# Altium schematic sheet QSPI Flash_eMMC_uSD-Card.SchDoc
size A3; SheetNumber: 14; SheetTotal: 22
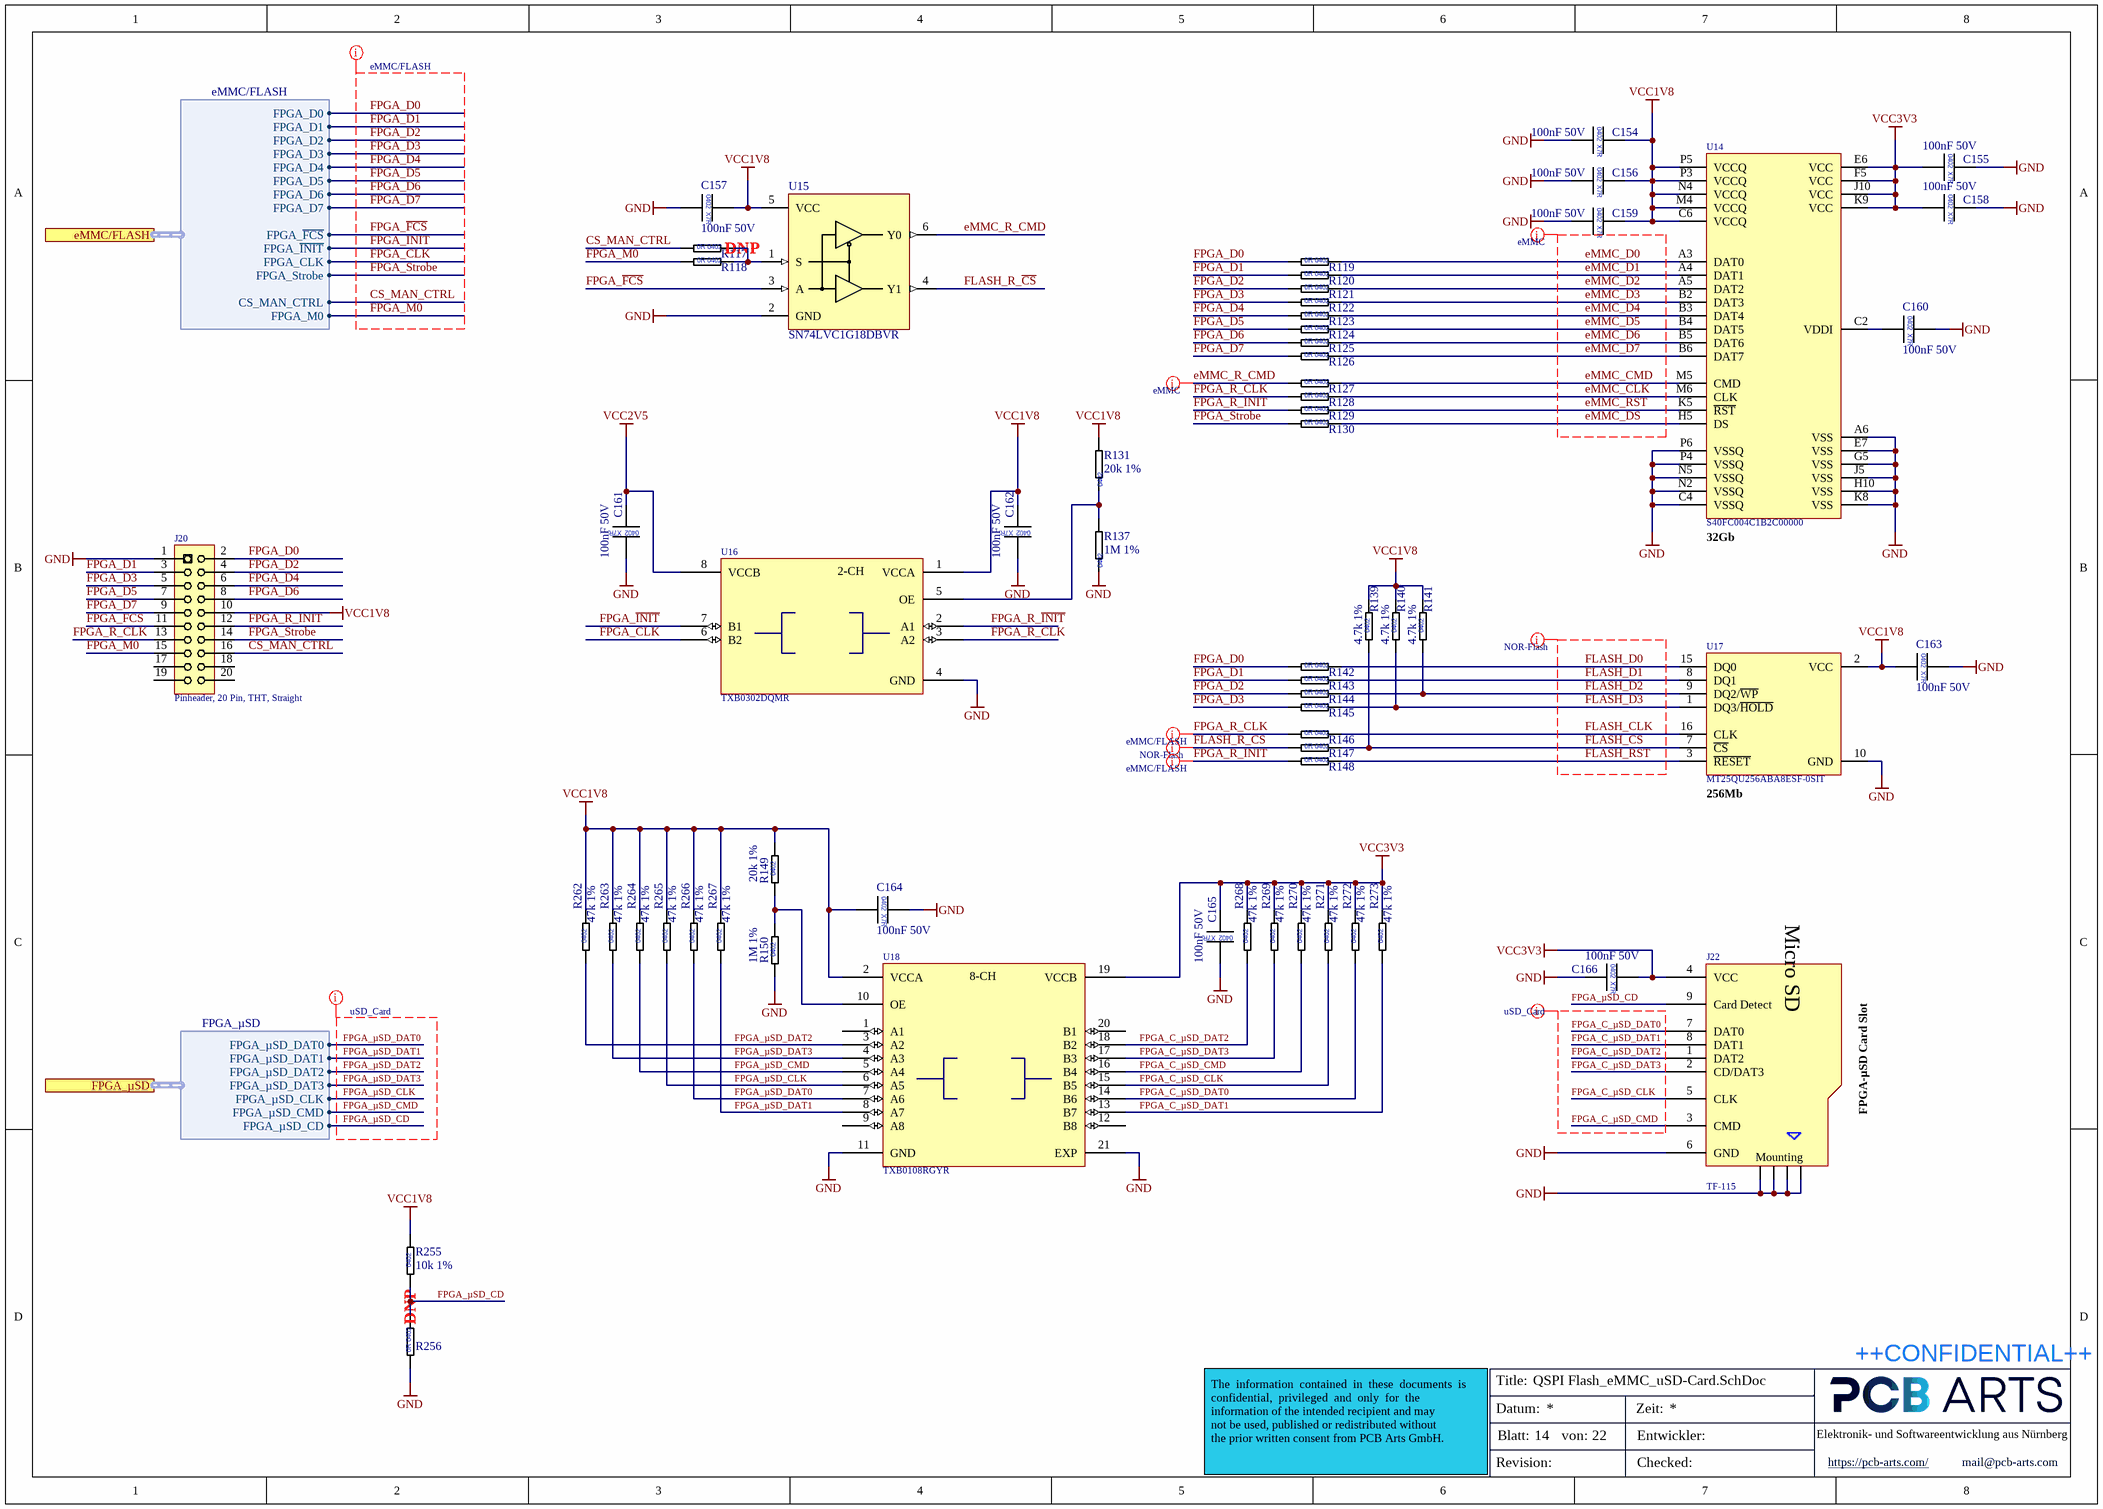
[diagram p0: QSPI Flash_eMMC_uSD-Card.SchDoc]

## Parts
C154  100nF 50V  [CAP_0402_L]
C155  100nF 50V  [CAP_0402_L]
C156  100nF 50V  [CAP_0402_L]
C157  100nF 50V  [CAP_0402_L]
C158  100nF 50V  [CAP_0402_L]
C159  100nF 50V  [CAP_0402_L]
C160  100nF 50V  [CAP_0402_L]
C161  100nF 50V  [CAP_0402_L]
C162  100nF 50V  [CAP_0402_L]
C163  100nF 50V  [CAP_0402_L]
C164  100nF 50V  [CAP_0402_L]
C165  100nF 50V  [CAP_0402_L]
C166  100nF 50V  [CAP_0402_L]
J20  Pinheader, 20 Pin, THT, Straight  [62702021621]
J22  TF-115  [TF-115]
R117  0R Jumper  [RES_0402_L]  (value not drawn)  (no BOM)
R118  0R Jumper  [RES_0402_L]  (value not drawn)
R119  0R Jumper  [RES_0402_L]  (value not drawn)
R120  0R Jumper  [RES_0402_L]  (value not drawn)
R121  0R Jumper  [RES_0402_L]  (value not drawn)
R122  0R Jumper  [RES_0402_L]  (value not drawn)
R123  0R Jumper  [RES_0402_L]  (value not drawn)
R124  0R Jumper  [RES_0402_L]  (value not drawn)
R125  0R Jumper  [RES_0402_L]  (value not drawn)
R126  0R Jumper  [RES_0402_L]  (value not drawn)
R127  0R Jumper  [RES_0402_L]  (value not drawn)
R128  0R Jumper  [RES_0402_L]  (value not drawn)
R129  0R Jumper  [RES_0402_L]  (value not drawn)
R130  0R Jumper  [RES_0402_L]  (value not drawn)
R131  20k 1%  [RES_0402_L]
R137  1M 1%  [RES_0402_L]
R139  4.7k 1%  [RES_0402_L]
R140  4.7k 1%  [RES_0402_L]
R141  4.7k 1%  [RES_0402_L]
R142  0R Jumper  [RES_0402_L]  (value not drawn)
R143  0R Jumper  [RES_0402_L]  (value not drawn)
R144  0R Jumper  [RES_0402_L]  (value not drawn)
R145  0R Jumper  [RES_0402_L]  (value not drawn)
R146  0R Jumper  [RES_0402_L]  (value not drawn)
R147  0R Jumper  [RES_0402_L]  (value not drawn)
R148  0R Jumper  [RES_0402_L]  (value not drawn)
R149  20k 1%  [RES_0402_L]
R150  1M 1%  [RES_0402_L]
R255  10k 1%  [RES_0402_L]
R256  0R Jumper  [RES_0402]  (value not drawn)  (no BOM)
R262  47k 1%  [RES_0402_L]
R263  47k 1%  [RES_0402_L]
R264  47k 1%  [RES_0402_L]
R265  47k 1%  [RES_0402_L]
R266  47k 1%  [RES_0402_L]
R267  47k 1%  [RES_0402_L]
R268  47k 1%  [RES_0402_L]
R269  47k 1%  [RES_0402_L]
R270  47k 1%  [RES_0402_L]
R271  47k 1%  [RES_0402_L]
R272  47k 1%  [RES_0402_L]
R273  47k 1%  [RES_0402_L]
U14  S40FC004C1B2C00000  [BGA50P900X750X080-153N]
U15  SN74LVC1G18DBVR  [SOT95P275X110-6N]
U16  TXB0302DQMR  [SON40P120X40-8N]
U17  MT25QU256ABA8ESF-0SIT  [SOIC16_Widebody]
U18  TXB0108RGYR  [QFN50P450X350X100-21N]

## Ports
eMMC/FLASH (harness eMMC/FLASH, see Top-Level-Sheet[3B], Bank 0_Bank 14[8A]), FPGA_µSD (harness FPGA_µSD, see Top-Level-Sheet[3B], SMI Bank 12[1B])

## Harnesses
FPGA_µSD: FPGA_µSD_DAT0, FPGA_µSD_DAT1, FPGA_µSD_DAT3, FPGA_µSD_CLK, FPGA_µSD_CMD, FPGA_µSD_DAT2, FPGA_µSD_CD
eMMC/FLASH: FPGA_D0, FPGA_D1, FPGA_D2, FPGA_D3, FPGA_D4, FPGA_D5, FPGA_D6, FPGA_D7, FPGA_~{FCS}, FPGA_~{INIT}, FPGA_CLK, FPGA_Strobe, FPGA_M0, CS_MAN_CTRL

## Nets
GND: C154.2 C155.1 C156.2 C157.2 C158.1 C159.2 C160.1 C161.1 C162.1 C163.1 C164.1 C165.1 C166.2 J20.1 J22.6(GND) J22.10 J22.11 J22.12 J22.13 R137.1 R150.1 R256.1 U14.A6(VSS) U14.C4(VSSQ) U14.E7(VSS) U14.G5(VSS) U14.H10(VSS) U14.J5(VSS) U14.K8(VSS) U14.N2(VSSQ) U14.N5(VSSQ) U14.P4(VSSQ) U14.P6(VSSQ) U15.2(GND) U16.4(GND) U17.10(GND) U18.11(GND) U18.21(EXP)
VCC1V8: C154.1 C156.1 C157.1 C159.1 C162.2 C163.2 C164.2 J20.10 R131.2 R139.2 R140.2 R141.2 R149.2 R255.2 R262.2 R263.2 R264.2 R265.2 R266.2 R267.2 U14.C6(VCCQ) U14.M4(VCCQ) U14.N4(VCCQ) U14.P3(VCCQ) U14.P5(VCCQ) U15.5(VCC) U16.1(VCCA) U17.2(VCC) U18.2(VCCA)
VCC2V5: C161.2 U16.8(VCCB)
VCC3V3: C155.2 C158.2 C165.2 C166.1 J22.4(VCC) R268.2 R269.2 R270.2 R271.2 R272.2 R273.2 U14.E6(VCC) U14.F5(VCC) U14.J10(VCC) U14.K9(VCC) U18.19(VCCB)
CS_MAN_CTRL: J20.16 R117.1 ; port eMMC/FLASH.CS_MAN_CTRL
eMMC_CLK: R128.2 U14.M6(CLK)
eMMC_CMD: R127.2 U14.M5(CMD)
eMMC_D0: R119.2 U14.A3(DAT0)
eMMC_D1: R120.2 U14.A4(DAT1)
eMMC_D2: R121.2 U14.A5(DAT2)
eMMC_D3: R122.2 U14.B2(DAT3)
eMMC_D4: R123.2 U14.B3(DAT4)
eMMC_D5: R124.2 U14.B4(DAT5)
eMMC_D6: R125.2 U14.B5(DAT6)
eMMC_D7: R126.2 U14.B6(DAT7)
eMMC_DS: R130.2 U14.H5(DS)
eMMC_~{RST}: R129.2 U14.K5(~{RST})
eMMC_R_CMD: R127.1 U15.6(Y0)
FLASH_~{CS}: R139.1 R147.2 U17.7(~{CS})
FLASH_CLK: R146.2 U17.16(CLK)
FLASH_D0: R142.2 U17.15(DQ0)
FLASH_D1: R143.2 U17.8(DQ1)
FLASH_D2: R141.1 R144.2 U17.9(DQ2/~{WP})
FLASH_D3: R140.1 R145.2 U17.1(DQ3/~{HOLD})
FLASH_~{RST}: R148.2 U17.3(~{RESET})
FLASH_R_~{CS}: R147.1 U15.4(Y1)
FPGA_C_µSD_CLK: J22.5(CLK) R271.1 U18.15(B5)
FPGA_C_µSD_CMD: J22.3(CMD) R270.1 U18.16(B4)
FPGA_C_µSD_DAT0: J22.7(DAT0) R272.1 U18.14(B6)
FPGA_C_µSD_DAT1: J22.8(DAT1) R273.1 U18.13(B7)
FPGA_C_µSD_DAT2: J22.1(DAT2) R268.1 U18.18(B2)
FPGA_C_µSD_DAT3: J22.2(CD/DAT3) R269.1 U18.17(B3)
FPGA_CLK: U16.6(B2) ; port eMMC/FLASH.FPGA_CLK
FPGA_D0: J20.2 R119.1 R142.1 ; port eMMC/FLASH.FPGA_D0
FPGA_D1: J20.3 R120.1 R143.1 ; port eMMC/FLASH.FPGA_D1
FPGA_D2: J20.4 R121.1 R144.1 ; port eMMC/FLASH.FPGA_D2
FPGA_D3: J20.5 R122.1 R145.1 ; port eMMC/FLASH.FPGA_D3
FPGA_D4: J20.6 R123.1 ; port eMMC/FLASH.FPGA_D4
FPGA_D5: J20.7 R124.1 ; port eMMC/FLASH.FPGA_D5
FPGA_D6: J20.8 R125.1 ; port eMMC/FLASH.FPGA_D6
FPGA_D7: J20.9 R126.1 ; port eMMC/FLASH.FPGA_D7
FPGA_~{FCS}: J20.11 U15.3(A) ; port eMMC/FLASH.FPGA_~{FCS}
FPGA_~{INIT}: U16.7(B1) ; port eMMC/FLASH.FPGA_~{INIT}
FPGA_M0: J20.15 R118.1 ; port eMMC/FLASH.FPGA_M0
FPGA_R_CLK: J20.13 R128.1 R146.1 U16.3(A2)
FPGA_R_~{INIT}: J20.12 R129.1 R148.1 U16.2(A1)
FPGA_Strobe: J20.14 R130.1 ; port eMMC/FLASH.FPGA_Strobe
FPGA_µSD_CD: J22.9(Card_Detect) R255.1 R256.2 ; port FPGA_µSD.FPGA_µSD_CD
FPGA_µSD_CLK: R265.1 U18.6(A5) ; port FPGA_µSD.FPGA_µSD_CLK
FPGA_µSD_CMD: R264.1 U18.5(A4) ; port FPGA_µSD.FPGA_µSD_CMD
FPGA_µSD_DAT0: R266.1 U18.7(A6) ; port FPGA_µSD.FPGA_µSD_DAT0
FPGA_µSD_DAT1: R267.1 U18.8(A7) ; port FPGA_µSD.FPGA_µSD_DAT1
FPGA_µSD_DAT2: R262.1 U18.3(A2) ; port FPGA_µSD.FPGA_µSD_DAT2
FPGA_µSD_DAT3: R263.1 U18.4(A3) ; port FPGA_µSD.FPGA_µSD_DAT3
NetC160_2: C160.2 U14.C2(VDDI)
NetR117_2: R117.2 R118.2 U15.1(S)
NetR131_1: R131.1 R137.2 U16.5(OE)
NetR149_1: R149.1 R150.2 U18.10(OE)

Not connected (* = marked no-connect by the designer): J20 17 18 19 20; U18 1(A1) 9(A8) 12(B8) 20(B1)

## Layout directives
net class uSD_Card: FPGA_C_µSD_CLK, FPGA_C_µSD_CMD, FPGA_C_µSD_DAT0, FPGA_C_µSD_DAT1, FPGA_C_µSD_DAT2, FPGA_C_µSD_DAT3, FPGA_µSD_CD, FPGA_µSD_CLK, FPGA_µSD_CMD, FPGA_µSD_DAT0, FPGA_µSD_DAT1, FPGA_µSD_DAT2, FPGA_µSD_DAT3
net class eMMC: eMMC_CLK, eMMC_CMD, eMMC_D0, eMMC_D1, eMMC_D2, eMMC_D3, eMMC_D4, eMMC_D5, eMMC_D6, eMMC_D7, eMMC_DS, eMMC_R_CMD, eMMC_~{RST}
net class NOR-Flash: FLASH_CLK, FLASH_D0, FLASH_D1, FLASH_D2, FLASH_D3, FLASH_R_~{CS}, FLASH_~{CS}, FLASH_~{RST}
net class eMMC/FLASH: CS_MAN_CTRL, FPGA_CLK, FPGA_D0, FPGA_D1, FPGA_D2, FPGA_D3, FPGA_D4, FPGA_D5, FPGA_D6, FPGA_D7, FPGA_M0, FPGA_R_CLK, FPGA_R_~{INIT}, FPGA_Strobe, FPGA_~{FCS}, FPGA_~{INIT}

## Notes on the sheet
- DNP
- (near U14) 32Gb
- (near U17) 256Mb
- FPGA-µSD Card Slot
- (near R256) DNP
- Title:
- ++CONFIDENTIAL++
- Datum:
- Blatt:
- von:
- Zeit:
- Entwickler:
- Elektronik- und Softwareentwicklung aus Nürnberg
- The  information  contained  in  these  documents  is  confidential,  privileged  and  only  for  the
  information of the intended recipient and may
  not be used, published or redistributed without
  the prior written consent from PCB Arts GmbH.
- Revision:
- Checked:
- https://pcb-arts.com/
- mail@pcb-arts.com
- (in symbol CAP_0402_100nF_50V) 0402; X7R
- (in symbol RES_0402_0R Jumper) 0R 0402
- (in symbol RES_0402_1M_1%) 0402
- (in symbol RES_0402_4.7k_1%) 0402
- (in symbol RES_0402_10k_1%) 0402
- (in symbol RES_0402_20k_1%) 0402
- (in symbol RES_0402_47k_1%) 0402
- (in symbol TF-115_microSD™ Memory Card 8 connector) Micro SD; Mounting
- (in symbol TXB0108RGYR_Translation - Voltage Levels 8B Bidir Vltg-Level Translator) 8-CH
- (in symbol TXB0302DQMR_Translation - Voltage Levels 2B Bidir Vltg-Level Translator) 2-CH

## Library data of the parts
C154-C166 = CAP_0402_100nF_50V: Multilayer Ceramic Capacitors MLCC - SMD/SMT 0402 50VDC; Manufacturer 1: Murata Electronics; Manufacturer 1 Prt. Nr.: GCM155L8EH104KE07D; Manufacturer 2 Prt. Nr.: UMK105B7104KV-FR; Manufacturer 2: TDK
J20 = 62702021621_Box Pin header THT 1.27mm 20Pol Straight: Box Pin header THT 1.27mm 20Pol Straight; Manufacturer 1: Würth Elektronik; Manufacturer 1 Prt. Nr.: 62702021621
J22 = TF-115_microSD™ Memory Card 8 connector: microSD™ Memory Card 8 connector&Ejector 14.5x14.75x1.85mm Card Sockets Connector; Manufacturer 1: XUNPU; Manufacturer 1 Prt. Nr.: TF-115
R117-R130 R142-R148 R256 = RES_0402_0R Jumper: Thick Film Resistors - SMD 0Ohm; Manufacturer 1: Vishay / Dale; Manufacturer 1 Prt. Nr.: CRCW04020000Z0EDC; Manufacturer 2 Prt. Nr.: RC0402JR-070RL; Manufacturer 2: Yageo
R131 R149 = RES_0402_20k_1%: Thick Film Resistors - SMD 20kOhm 1%; Manufacturer 1: Vishay / Dale; Manufacturer 1 Prt. Nr.: CRCW040220K0FKEDC; Manufacturer 2 Prt. Nr.: RC0402FR-7D20KL; Manufacturer 2: Yageo
R137 R150 = RES_0402_1M_1%: Thick Film Resistors - SMD 1MOhm 1%; Manufacturer 1: Vishay / Dale; Manufacturer 1 Prt. Nr.: CRCW04021M00FKEDC; Manufacturer 2 Prt. Nr.: RC0402FR-071ML; Manufacturer 2: Yageo
R139-R141 = RES_0402_4.7k_1%: Thick Film Resistors - SMD 4.7kOhm 1%; Manufacturer 1: Vishay / Dale; Manufacturer 1 Prt. Nr.: CRCW04024K70FKEDC; Manufacturer 2 Prt. Nr.: RC0402FR-134K7L; Manufacturer 2: Yageo
R255 = RES_0402_10k_1%: Thick Film Resistors - SMD 10kOhm 1%; Manufacturer 1: Vishay / Dale; Manufacturer 1 Prt. Nr.: CRCW040210K0FKEDC; Manufacturer 2 Prt. Nr.: RC0402FR-7W10KL; Manufacturer 2: Yageo
R262-R273 = RES_0402_47k_1%: Thick Film Resistors - SMD 47kOhm 1%; Manufacturer 1: Vishay / Dale; Manufacturer 1 Prt. Nr.: CRCW040247K0FKEDC; Manufacturer 2 Prt. Nr.: RC0402FR-7W47KL; Manufacturer 2: Yageo
U14 = S40FC004C1B2C00000_eMMC 4GB e.MMC5.1 BGA 9.0 x 7.5 x 0.8 mm: eMMC 4GB e.MMC5.1 BGA 9.0 x 7.5 x 0.8 mm; Manufacturer 1: SkyHigh Memory; Manufacturer 1 Prt. Nr.: S40FC004C1B2C00000
U15 = SN74LVC1G18DBVR_1:2 Noninverting Demultiplexer With 3-State Deselected Output: 1:2 Noninverting Demultiplexer With 3-State Deselected Output; Manufacturer 1: Texas Instruments; Manufacturer 1 Prt. Nr.: SN74LVC1G18DBVR
U16 = TXB0302DQMR_Translation - Voltage Levels 2B Bidir Vltg-Level Translator: Translation - Voltage Levels 2B Bidir Vltg-Level Translator; Manufacturer 1: Texas Instruments; Manufacturer 1 Prt. Nr.: TXB0302DQMR
U17 = MT25QU256ABA8ESF-0SIT_NOR-Flash SPI 256Mbit NOR-Flash /1.8V: NOR-Flash SPI 256Mbit NOR-Flash /1.8V; Manufacturer 1: Micron; Manufacturer 1 Prt. Nr.: MT25QU256ABA8ESF-0SIT
U18 = TXB0108RGYR_Translation - Voltage Levels 8B Bidir Vltg-Level Translator: Translation - Voltage Levels 8B Bidir Vltg-Level Translator; Manufacturer 1: Texas Instruments; Manufacturer 1 Prt. Nr.: TXB0108RGYR